# Altium schematic sheet Final.SchDoc
size C; SheetNumber: 1; SheetTotal: 1
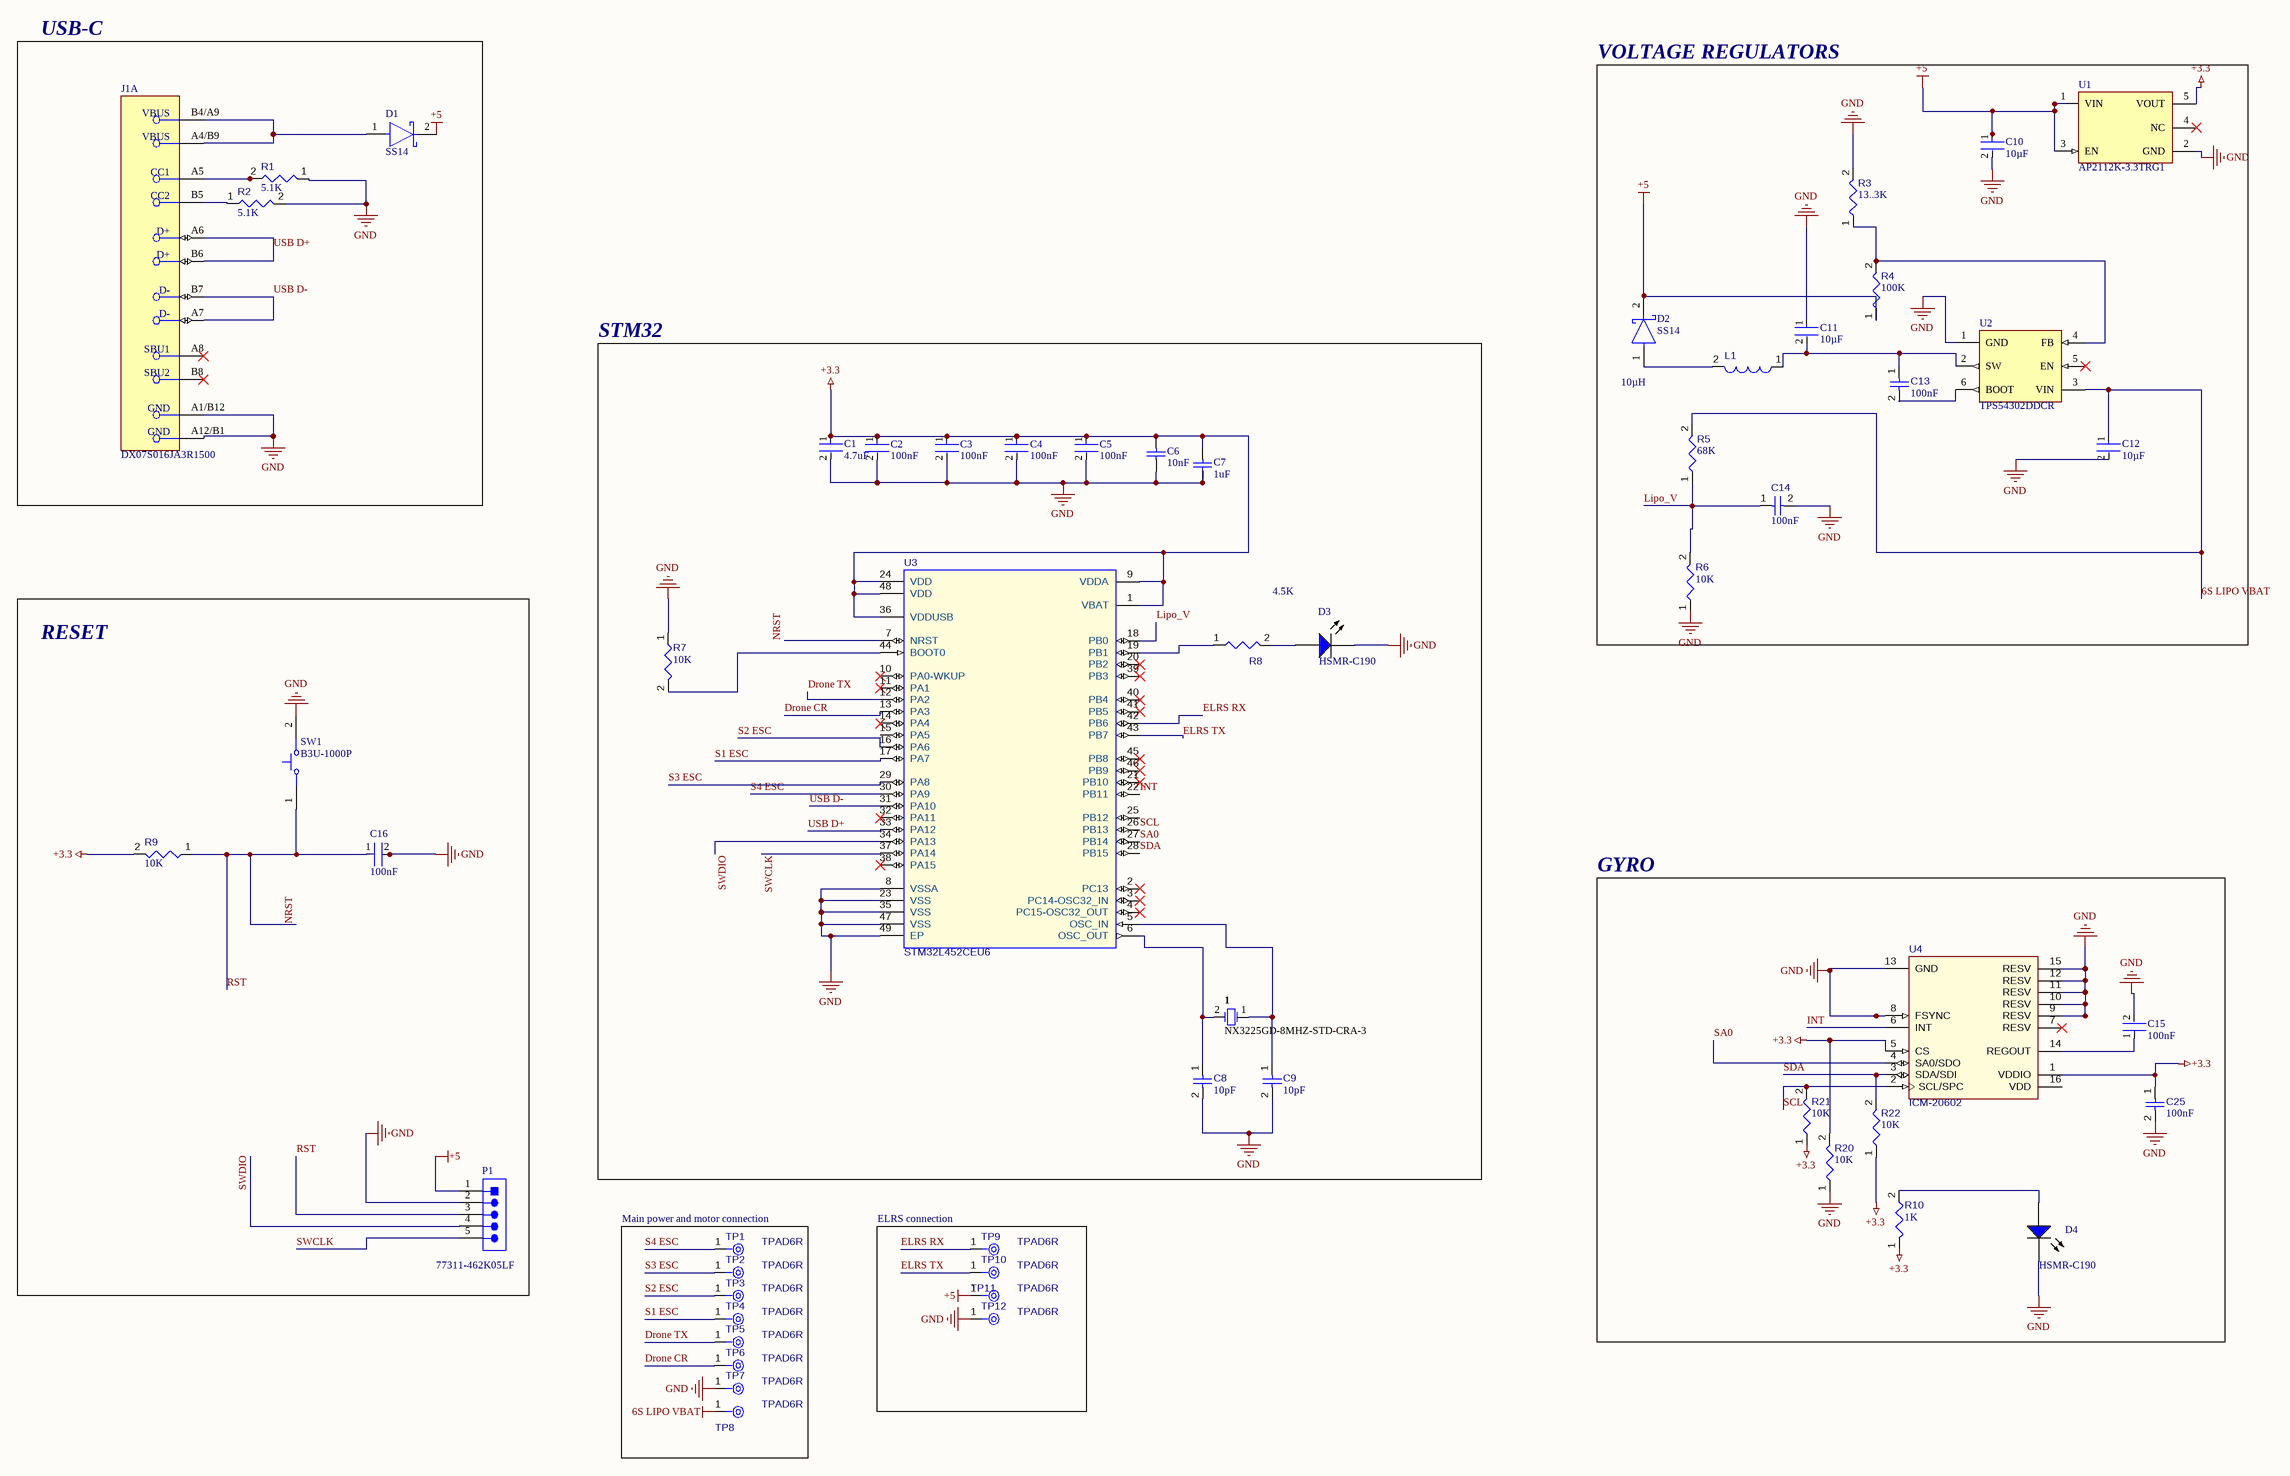
[diagram p0: Final.SchDoc]

## Parts
1  NX3225GD-8MHZ-STD-CRA-3  [NDK-NX3225GD-8MHZ-STD-CRA-3_V]
C1  4.7uF  [FP-GRM188-0_15-MFG]
C2  100nF  [FP-0402YC104KAT2A-MFG]
C3  100nF  [FP-0402YC104KAT2A-MFG]
C4  100nF  [FP-0402YC104KAT2A-MFG]
C5  100nF  [FP-0402YC104KAT2A-MFG]
C6  10nF  [CAPC1005X55X25LL05T10]
C7  1uF  [CAPC1608X90X35NL10T15]
C8  value 10pF  [CAPC1005X55X25ML05T05]  (hidden comment: Capacitor 10 pF +/- 5% 50 V 0402)
C9  value 10pF  [CAPC1005X55X25ML05T05]  (hidden comment: Capacitor 10 pF +/- 5% 50 V 0402)
C10  10µF  [FP-0805-L_2_0_0_15-W_1_25-MFG]
C11  10µF  [FP-0805-L_2_0_0_15-W_1_25-MFG]
C12  10µF  [FP-0805-L_2_0_0_15-W_1_25-MFG]
C13  value 100nF  [CAPC0402(1005)60_L]  (hidden comment: Capacitor 100nF +/-20% 50V 0402)
C14  value 100nF  [CAPC0402(1005)60_L]  (hidden comment: Capacitor 100nF +/-20% 50V 0402)
C15  100nF  [FP-0402YC104KAT2A-MFG]
C16  100nF  [FP-0402YC104KAT2A-MFG]
C25  value 100nF  [CAPC1005X56X25LL10T15]  (hidden comment: Capacitor 0.1 uF +/- 5% 16 V 0402)
D1  SS14  [FP-403AE-MFG]
D2  SS14  [FP-403AE-MFG]
D3  HSMR-C190  [AVAG-HSMX-C190_V]
D4  HSMR-C190  [AVAG-HSMX-C190_V]
J1  DX07S016JA3R1500  [FP-DX07S016JA3R1500-MFG]  (part A of 2)
L1  value 10µH  [INDC2520X100X60NL20T20]  (hidden comment: LQM2HPN2R2MG0L)
P1  77311-462K05LF  [FCI-77311-5_V]
R1  value 5.1K  [RESC0402(1005)_L]  (hidden comment: Resistor 2K37 +/-1 % 0402 63 mW)
R2  value 5.1K  [RESC0402(1005)_L]  (hidden comment: Resistor 2K37 +/-1 % 0402 63 mW)
R3  value 13..3K  [RESC0402(1005)_L]  (hidden comment: Resistor 2K37 +/-1 % 0402 63 mW)
R4  value 100K  [RESC0402(1005)_L]  (hidden comment: 100KR2F)
R5  value 68K  [RESC0402(1005)_L]  (hidden comment: Resistor 2K37 +/-1 % 0402 63 mW)
R6  value 10K  [RESC0402(1005)_L]  (hidden comment: Resistor 2K37 +/-1 % 0402 63 mW)
R7  value 10K  [RESC0402(1005)_L]  (hidden comment: Resistor 2K37 +/-1 % 0402 63 mW)
R8  value 4.5K  [RESC0402(1005)_L]  (hidden comment: Resistor 2K37 +/-1 % 0402 63 mW)
R9  value 10K  [RESC0402(1005)_L]  (hidden comment: Resistor 2K37 +/-1 % 0402 63 mW)
R10  value 1K  [RESC0402(1005)_L]  (hidden comment: Resistor 2K37 +/-1 % 0402 63 mW)
R20  value 10K  [RESC0402(1005)_L]  (hidden comment: Resistor 2K37 +/-1 % 0402 63 mW)
R21  value 10K  [RESC0402(1005)_L]  (hidden comment: Resistor 2K37 +/-1 % 0402 63 mW)
R22  value 10K  [RESC0402(1005)_L]  (hidden comment: Resistor 2K37 +/-1 % 0402 63 mW)
SW1  B3U-1000P  [OMRON-B3U-1000_V]
TP1  TPAD6R  [TP06R]  (no BOM)
TP2  TPAD6R  [TP06R]  (no BOM)
TP3  TPAD6R  [TP06R]  (no BOM)
TP4  TPAD6R  [TP06R]  (no BOM)
TP5  TPAD6R  [TP06R]  (no BOM)
TP6  TPAD6R  [TP06R]  (no BOM)
TP7  TPAD6R  [TP06R]  (no BOM)
TP8  TPAD6R  [TP06R]  (no BOM)
TP9  TPAD6R  [TP06R]  (no BOM)
TP10  TPAD6R  [TP06R]  (no BOM)
TP11  TPAD6R  [TP06R]  (no BOM)
TP12  TPAD6R  [TP06R]  (no BOM)
U1  AP2112K-3.3TRG1  [FP-SOT25-IPC_A]
U2  TPS54302DDCR  [FP-DDC0006A-MFG]
U3  STM32L452CEU6  [STM-UFQFPN48_N]
U4  ICM-20602  [INSE-I62-16]

## Blocks framed on the sheet
USB-C: D1 J1 R1 R2
VOLTAGE REGULATORS: C10-C14 D2 L1 R3-R6 U1 U2
STM32: 1 C1-C9 D3 R7 R8 U3
RESET: C16 P1 R9 SW1
GYRO: C15 C25 D4 R10 R20-R22 U4
Main power and motor connection: TP1-TP8
ELRS connection: TP9-TP12

## Nets
6S LIPO VBAT: C12.1 R5.2 TP8.1(TP) U2.3(VIN)
+3.3: C1.1 C2.1 C3.1 C4.1 C5.1 C6.1 C7.2 C25.1 R9.2 R10.1 R20.2 R21.1 R22.1 U1.5(VOUT) U3.1(VBAT) U3.9(VDDA) U3.24(VDD) U3.36(VDDUSB) U3.48(VDD) U4.1(VDDIO) U4.5(CS)
+5: C10.1 D1.2(C) D2.2(C) P1.1(DTR) R4.1 TP11.1(TP) U1.1(VIN) U1.3(EN)
GND: C1.2 C2.2 C3.2 C4.2 C5.2 C6.2 C7.1 C8.2 C9.2 C10.2 C11.1 C12.2 C14.2 C15.2 C16.2 C25.2 D3.2(K) D4.2(K) J1.A1/B12(GND) J1.A12/B1(GND) P1.2(RXI) R1.1 R2.2 R3.2 R6.1 R7.1 R20.1 SW1.2 TP7.1(TP) TP12.1(TP) U1.2(GND) U2.1(GND) U3.8(VSSA) U3.23(VSS) U3.35(VSS) U3.47(VSS) U3.49(EP) U4.8(FSYNC) U4.9(RESV) U4.10(RESV) U4.11(RESV) U4.12(RESV) U4.13(GND) U4.15(RESV)
Drone CR: TP6.1(TP) U3.13(PA3)
Drone TX: TP5.1(TP) U3.12(PA2)
ELRS RX: TP9.1(TP) U3.42(PB6)
ELRS TX: TP10.1(TP) U3.43(PB7)
INT: U3.22(PB11) U4.6(INT)
Lipo_V: C14.1 R5.1 R6.2 U3.18(PB0)
NRST: C16.1 P1.3(TXO) R9.1 SW1.1 U3.7(NRST)  [also labelled RST]
S1 ESC: TP4.1(TP) U3.17(PA7)
S2 ESC: TP3.1(TP) U3.16(PA6)
S3 ESC: TP2.1(TP) U3.29(PA8)
S4 ESC: TP1.1(TP) U3.30(PA9)
SA0: U3.27(PB14) U4.4(SA0/SDO)
SCL: R21.2 U3.26(PB13) U4.2(SCL/SPC)
SDA: R22.2 U3.28(PB15) U4.3(SDA/SDI)
SWCLK: P1.5(CTS) U3.37(PA14)
SWDIO: P1.4(VCC) U3.34(PA13)
USB D+: J1.A6(D+) J1.B6(D+) U3.33(PA12)
USB D-: J1.A7(D-) J1.B7(D-) U3.31(PA10)
Net1_1: 1.1 C9.1 U3.5(OSC_IN)
Net1_2: 1.2 C8.1 U3.6(OSC_OUT)
NetC11_2: C11.2 C13.1 L1.1 U2.2(SW)
NetC13_2: C13.2 U2.6(BOOT)
NetC15_1: C15.1 U4.14(REGOUT)
NetD1_1: D1.1(A) J1.A4/B9(VBUS) J1.B4/A9(VBUS)
NetD2_1: D2.1(A) L1.2
NetD3_1: D3.1(A) R8.2
NetD4_1: D4.1(A) R10.2
NetJ1_A5: J1.A5(CC1) R1.2
NetJ1_B5: J1.B5(CC2) R2.1
NetR3_1: R3.1 R4.2 U2.4(FB)
NetR7_2: R7.2 U3.44(BOOT0)
NetR8_1: R8.1 U3.19(PB1)

Not connected (* = marked no-connect by the designer): J1 A8(SBU1)* B8(SBU2)*; U1 4(NC)*; U2 5(EN)*; U3 2(PC13)* 3(PC14-OSC32_IN)* 4(PC15-OSC32_OUT)* 10(PA0-WKUP)* 11(PA1)* 14(PA4)* 15(PA5) 20(PB2)* 21(PB10)* 25(PB12) 32(PA11)* 38(PA15)* 39(PB3)* 40(PB4)* 41(PB5)* 45(PB8)* 46(PB9)*; U4 7(RESV)* 16(VDD)

## Library data of the parts
1 = CMP-2000-07595-1: Crystal Unit, 8 MHz, 8 pF, -40 to 150 degC, 2-Pin SMD, RoHS, Tape and Reel; Manufacturer: NDK; Load Capacitance: 8pF; ESR (Equivalent Series Resistance): 500Ohm; Frequency Tolerance: 50ppm; Frequency Stability: 150ppm; Frequency: 8MHz; Case/Package: SMD/SMT; Datasheet Version: 11/2016; Min Operating Temperature: -40degC; Packaging: TapeandReel; Width: 0.098inch; Package Quantity: 3000; Number of Pins: 2; Package Description: 2-Pin Surface Mount Device, Body 3.2 x 2.5 mm; RoHSCompliant: True; Package Reference: NX3225GD-8MHZ-STD-CRA-3; Datasheet URL: http://www.ndk.com/images/products/catalog/c_NX3225GD-STD-CRA-3_e.pdf; Mounting Technology: SurfaceMount; Length: 0.126inch; Mount: SurfaceMount; Manufacturer URL: http://www.ndk.com/en/; Max Operating Temperature: 150degC; Height: 0.039inch
C1 = CMP-06035-062935-2: CAP CER 4.7UF 16V X5R 0603; NexarPartId: 20311162; Material: Ceramic; Capacitance: 4.7µF; Tolerance: 10%; Lead Free: Lead Free; Weight: 6.293594mg; Max Operating Temperature: 85°C; Thickness: 939.8µm; RoHS: Compliant; Case Code (Imperial): 0603; Case Code (Metric): 1608; Depth: 800µm; Schedule B: 8532240020; Width: 800µm; Lifecycle Status: Production; Voltage Rating: 16V; REACH SVHC: No SVHC; Height: 800µm; Case/Package: 0603; Voltage Rating (DC): 16V; Mount: Surface Mount; Dielectric: X5R; Termination: SMD/SMT; Packaging: Tape & Reel (TR); Length: 1.6mm; Min Operating Temperature: -55°C
C2-C5 C15 C16 = CMP-2008-02800-2: NexarPartId: 71036144; Voltage Rating: 16V; Dielectric: X7R; Tolerance: 10%; Material: Ceramic; RoHS: Compliant; Lead Free: Lead Free; REACH SVHC: Unknown; Depth: 500µm; Capacitance: 100nF; Radiation Hardening: No; Height: 560µm; Case/Package: 0402; Thickness: 558.8µm; Mount: PCB, Surface Mount; Lifecycle Status: Production; Min Operating Temperature: -55°C; Voltage Rating (DC): 16V; Max Operating Temperature: 125°C; Case Code (Metric): 1005; Case Code (Imperial): 0402; Packaging: Cut Tape; Number of Pins: 2; Schedule B: 8532240020; Voltage: 16V; Width: 508µm; Length: 1mm; Contact Plating: Tin; Dielectric Material: Ceramic; Termination: SMD/SMT
C6 = CMP-2000-06332-1: Chip Capacitor, 10 nF, 16 V, 10%, -55 to 125 degC, 0402 (1005 Metric), RoHS, Tape and Reel; Manufacturer: Murata; Rated Voltage: 16V; Capacitance: 10000pF; Dielectric: X7R; Manufacturer URL: http://www.murata.com/; Package Description: 2-Pin Surface Mount Device, Body 1 x 0.5 mm; Case Size/Dimension: 0402; Tolerance (%): ±10%; Datasheet Version: 06/2016; Package Reference: 0402; Mounting Technology: SurfaceMount; Datasheet URL: http://psearch.en.murata.com/capacitor/product/GRM155R71C103KA01%23.pdf
C7 = CMP-2006-02812-1: Manufacturer: Murata; Part Number: GRM188R61C105KA12D
C8 C9 = CMP-001-00013-6: Chip Capacitor, 10 pF, +/- 5%, 50 V, 0402 (1005 Metric); Capacitor Type: Ceramic; Voltage Rating: 50V; Max Operating Temperature: 125°C; Pins: 2; Mounting Technology: SM; Tolerance: 5%; RoHS Compliant: True; Case/Package: 0402; Min Operating Temperature: -55°C
C10-C12 = CMP-14477-004998-2: Multilayer Ceramic Capacitor 10 uF 16V X5R 10% SMD 0805 T/R; Capacitance: 10uF; Thickness: 0.053inch; Tolerance: 10%; Termination: Wraparound; Packaging: Tape and Reel; Contact Plating: Tin; Min Operating Temperature: -55°C; Voltage Rating: 16V; RoHS Compliant: Yes; Max Operating Temperature: 85°C; Case/Package: 0805; Length: 0.079inch; Width: 0.049inch; Dielectric: X5R; Mount: Surface Mount
C13 C14 = CMP-001-00067-3: Chip Capacitor, 100nF +/-20%, 50V, 0402, Thickness 0.6 mm; Tolerance: 10%; Min Operating Temperature: -55°C; Pins: 2; Case/Package: 0402; Max Operating Temperature: 85°C; Voltage Rating: 50V; Mounting Technology: SMT
C25 = CMP-001-00001-6: Chip Capacitor, 0.1 uF, +/- 5%, 16 V, 0402 (1005 Metric); Capacitor Type: Ceramic; Voltage Rating: 16V; Max Operating Temperature: 125°C; Min Operating Temperature: -55°C; Case/Package: 0402; Mounting Technology: SM; Pins: 2; Tolerance: 5%; RoHS Compliant: True
D1 D2 = CMP-2000-04943-2: DIODE SCHOTTKY 40V 1A SMA; Manufacturer: ON Semiconductor; Peak Reverse Current: 0.2mA; Max Junction Temp: +125°C; Standoff Height: 0.05mm; Max Surge Forward Current: 40A; Mouser Description: Schottky Diodes & Rectifiers SMA 40V 1.0A; RoHS: TRUE; Lead Free: Yes; Manufacturer Part Number: SS14; Device Class L3: Schottky Diodes; Category: Diode; Automotive: No; Digikey Description: DIODE SCHOTTKY 40V 1A SMA; ComponentLink2Description: Datasheet; Device Class L2: Diodes; Height: 2.5mm; Temperature Range High: +125°C; ComponentLink2URL: https://www.onsemi.com/pub/Collateral/SS19-D.PDF; Device Class L1: Discrete Semiconductors; Package: 403AE; Octopart: https://octopart.com/ss14-on+semiconductor-29205033; Max Repetitive Reverse Voltage: 40V; Temperature Range Low: -65°C; Forward Current: 1A; Temperature: -65°C to +125°C
D3 D4 = CMP-007-00015-2: LED Uni-Color Blue, 78 mW, 20 mA, -40 to 85 degC, 2-Pin SMD, RoHS, Tape and Reel; Manufacturer: Avago; Forward Voltage: 3.4V; Power: 78mW; Forward Current: 20mA; Luminous Intensity: 55mcd; Lens Style: Diffused; Viewing Angle: 155degrees; Pins: 2; Max Operating Temperature: 85°C; Colour: Blue; Datasheet Version: Apr-10; RoHS Compliant: True; Mounting Technology: SM; Min Operating Temperature: -40°C; Illumination Colour: Blue; Package Quantity: 4000; Datasheet URL: http://docs.avagotech.com/docs/AV02-0977EN; Package Reference: HSMX-C190; Packaging: TapeandReel; Nominal Vf: 3.4V; Case/Package: 0603; Package Description: 2-Pin Surface Mount Device, Body 1.6 x 0.8 mm, Height 0.9 mm; Manufacturer URL: http://www.avagotech.com/
J1 = CMP-19038-000002-1: CONN RCP USB2.0 TYP C 24P SMD RA
L1 = CMP-006-00009-6: Chip Inductor, 2.2 uH, +/- 20%, -55 to 125 degC, 1008 (2520 Metric), RoHS, Tape and Reel; Manufacturer: Murata; Self Resonant Frequency: 40MHz; Current Rating: 1.3A; Core Material: Ferrite; Shielding: Shielded; Package Description: 2-Pin Surface Mounted Device, Body 2.5 x 2 mm; Tolerance: 20%; Max Operating Temperature: 125°C; Mounting Technology: SM; Package Reference: 1008; Case/Package: 1008; RoHS Compliant: True; Package Quantity: 3000; Packaging: TapeandReel; Min Operating Temperature: -55°C; Datasheet URL: http://psearch.en.murata.com/inductor/product/LQM2HPN2R2MG0%23.pdf; Datasheet Version: Aug-16
P1 = CMP-002-00021-2: Male Header, Pitch 2.54 mm, 1 x 5 Position, Height 16.24 mm, Tail Length 3.05 mm, -65 to 125 degC, RoHS, Tape and Reel; Manufacturer: FCI Electronics; Connector Type: Header; Manufacturer URL: http://portal.fciconnect.com/; Datasheet URL: http://portal.fciconnect.com/Comergent//fci/drawing/77311.pdf; Gender: Male; Case/Package: 77311-5; Package Reference: 77311-5; Datasheet Version: Rev. CK, 07/2016; Package Description: Male Header, Pitch 2.54 mm, 1 x 5 Position, Height 16.24 mm, Tail Length 3.05 mm; RoHS Compliant: Unknown; Mounting Technology: TH
R1-R3 R5-R10 R20-R22 = CMP-009-00162-3: Chip Resistor, 2,37 kOhms, +/-1 %, 63 mW, -55 to 155 degC, 0402; Power: 63mW; Tolerance: 1%; Pins: 2; Max Operating Temperature: 155°C; Min Operating Temperature: -55°C; Case/Package: 0402
R4 = CMP-009-00064-2: 100K 0.063W 1% 0402 (1005 Metric)  SMD; Power: 63mW; Case/Package: 0402; Mounting Technology: SMT; Pins: 2; Tolerance: 1%
SW1 = CMP-011-00000-2: Tactile Switch, SPST-NO, 0.05 A, 12 V, -25 to 70 degC, 2-Pin SMD, RoHS, Tape and Reel; Manufacturer: Omron Electronic Components; IP Rating: IP40; Current Rating: 50mA; Max Contact Resistance: 100mohm; Operating Force: 153gf; Throw Configuration: SPST; Resistance: 0.1Ohm; Max Voltage Rating (DC): 12V; Contact Material: Silver; Max Current Rating: 50mA; Datasheet URL: http://www.omron.com/ecb/products/pdf/en-b3u.pdf; Mounting Technology: SM; Case/Package: B3U-1000; Packaging: TapeandReel; Package Reference: B3U-1000; Manufacturer URL: http://www.omron.com/; Datasheet Version: Jan-15; RoHS Compliant: True; Max Operating Temperature: 70°C; Contact Current Rating: 50mA; Package Quantity: 3500; Package Description: 2-Pin Surface Mount Device, Body 3 x 2.5 mm; Voltage Rating (DC): 12V; Min Operating Temperature: -25°C; Voltage Rating: 12V
TP1-TP12 = CMP-00028-00002-2: 0.6mm round; Pins: 1
U1 = CMP-12756-000035-1: IC REG LINEAR 3.3V 600MA SOT25; Number of Regulators: 1; Output Type: Fixed; Polarity: Positive; Min Input Voltage: 2.5V; Max Input Voltage: 6V; Accuracy: 1.5%; Quiescent Current: 55uA; Dropout Voltage: 250mV; Min Operating Temperature: -40°C; Length: 3.1mm; Output Current: 600mA; Max Operating Temperature: 85°C; Package Quantity: 1; Output Voltage: 3.3V; Width: 1.7mm; Number of Outputs: 1; Packaging: Tape and Reel; Height: 1.3mm; Lead Free: Lead Free; Max Output Current: 600mA; Case/Package: SOT-23-5; Mount: Surface Mount; Number of Pins: 5
U2 = CMP-04918-000032-1: IC REG BUCK ADJ 3A TSOT23-6; Manufacturer: Texas Instruments; Output Voltage: 0.6-26V; Output Type: AdjustableProgrammable; Max Junction Temp: +125°C; Number Of Outputs: 1; Min Supply Voltage: 4.5V; Switching Frequency: 400kHz; Standoff Height: 0mm; Max Duty Cycle: 100%; Nominal Supply Current: 45uA; Max Supply Voltage: 28V; Temperature Range High: +125°C; Switching Topology: Buck; Device Class L2: Power Management ICs; Output Current: 3A; Automotive: No; Temperature Range Low: -40°C; Temperature: -40°C to +125°C; Height: 1.1mm; Ipc Land Pattern Name: SOT95P280X110-6; RoHS: TRUE; Digikey Description: IC REG BUCK ADJ 3A TSOT23-6; Manufacturer Part Number: TPS54302DDCR; ComponentLink2Description: Datasheet; Device Class L3: Voltage Regulators - Switching; Octopart: https://octopart.com/tps54302ddcr-texas+instruments-74209025; Device Class L1: Integrated Circuits (ICs); Lead Free: Yes; ComponentLink2URL: http://www.ti.com/lit/ds/symlink/tps54302.pdf; Category: IC; Package: DDC0006A
U3 = CMP-020-00022-3: ARM® Cortex®-M4 STM32L4 Microcontroller IC 32-Bit 80MHz 512KB (512K x 8) FLASH 48-UFQFPN (7x7); I/Os: 38; RAM Size: 160; Min Supply Voltage: 2V; ComponentLink1URL: http://www.st.com/; ComponentLink2Description: Datasheet; Mounting Technology: Surface Mount; ComponentLink2URL: http://www.st.com/st-web-ui/static/active/en/resource/technical/document/datasheet/CD00161566.pdf; Case/Package: UFQFN-48; Pins: 49; RoHS Compliant: Yes; ComponentLink1Description: Manufacturer URL
U4 = CMP-010-00023-3: High Performance 6-Axis MEMS MotionTracking(TM) Device, 1.71 to 3.45 V, -40 to 85 degC, 16-Pin LGA, RoHS; Max Supply Voltage: 3.45V; Sensor Type: 6 Axis,Accelerometer,Gyroscope,Temperature; Min Supply Voltage: 1.71V; Mounting Technology: SMT; Max Operating Temperature: 85°C; Min Operating Temperature: -40°C; Pins: 16; Case/Package: LGA-16; RoHS Compliant: Yes